# EAGLE design 9volt_rail (EAGLE 7.1.0)
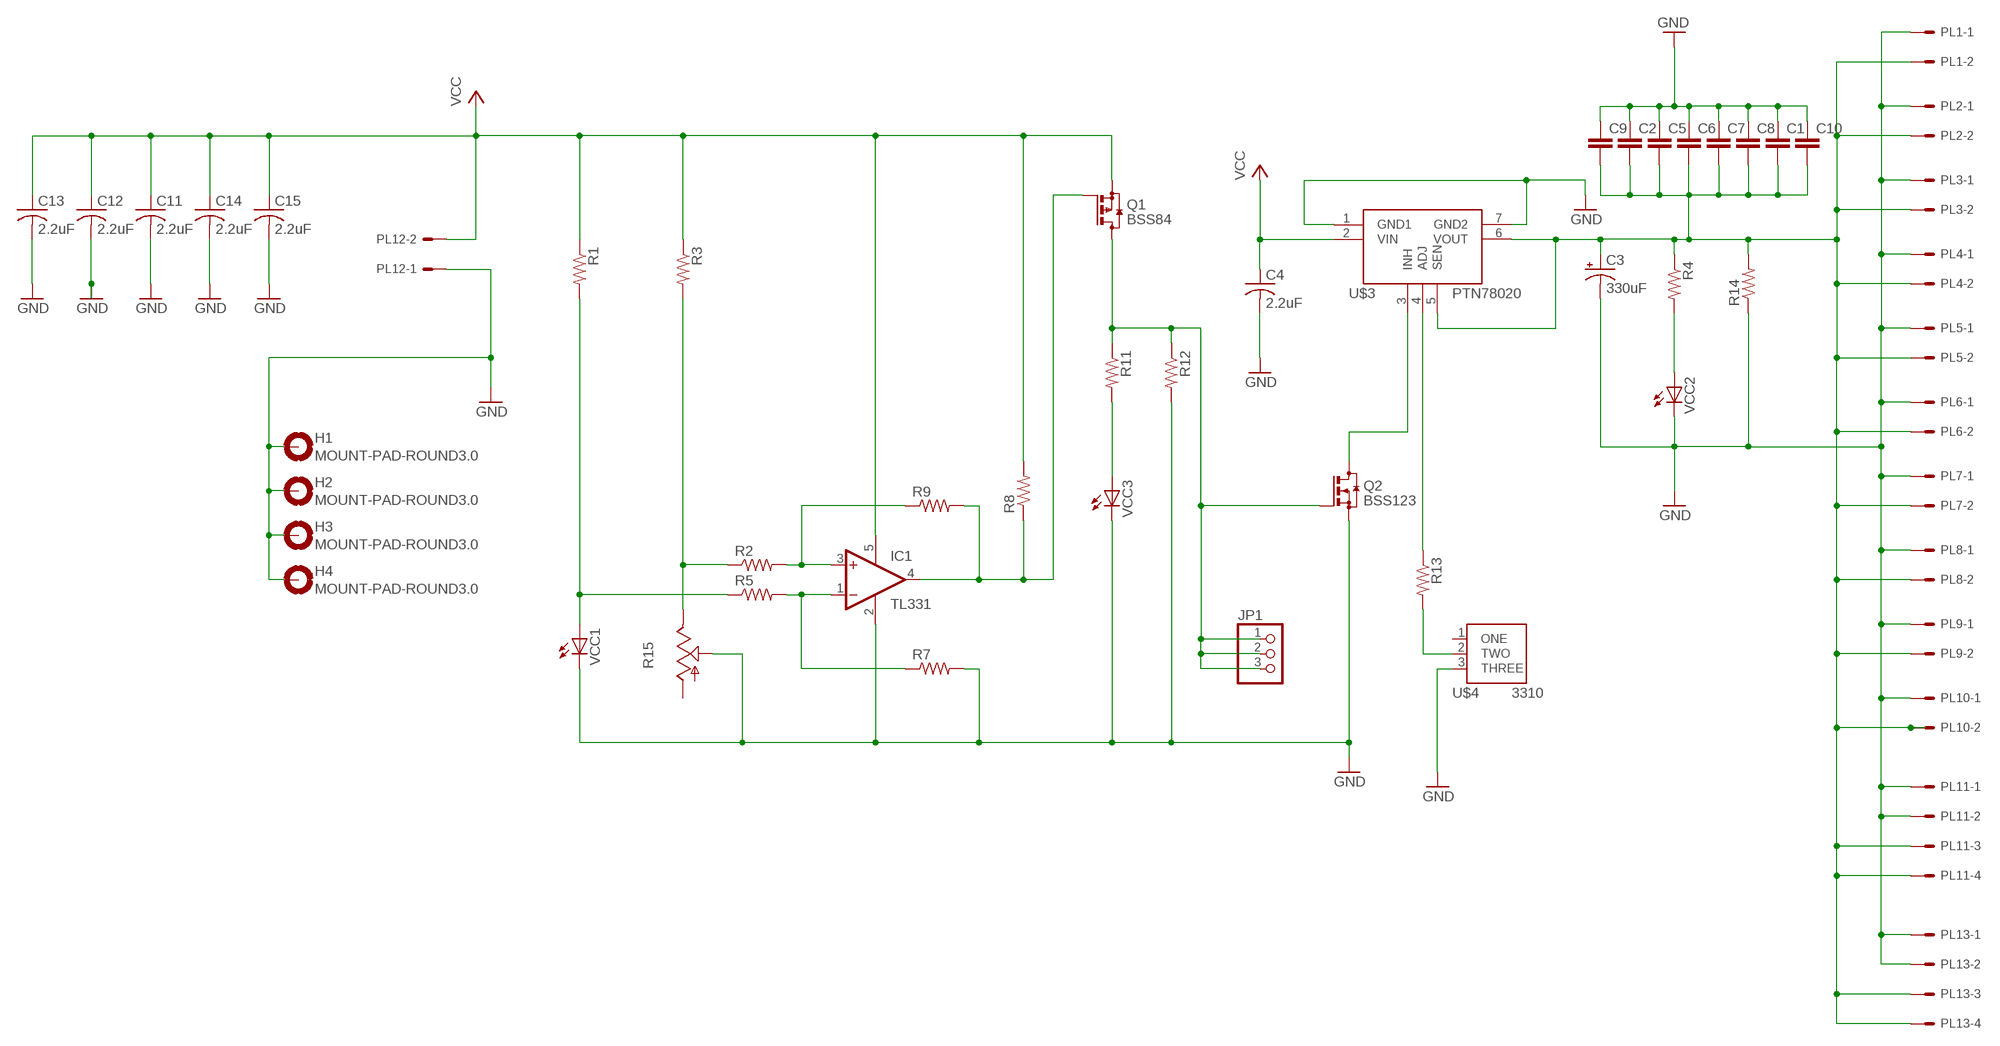
[diagram p0: schematic, sheet 1]

## Parts
C1  C-EUC0805  [C0805]
C2  C-EUC0805  [C0805]
C3  330uF  CPOL-USE5-10.5  [E5-10,5]
C4  2.2uF  C-USC0805  [C0805]
C5  C-EUC0805  [C0805]
C6  C-EUC0805  [C0805]
C7  C-EUC0805  [C0805]
C8  C-EUC0805  [C0805]
C9  C-EUC0805  [C0805]
C10  C-EUC0805  [C0805]
C11  2.2uF  C-USC0805  [C0805]
C12  2.2uF  C-USC0805  [C0805]
C13  2.2uF  C-USC0805  [C0805]
C14  2.2uF  C-USC0805  [C0805]
C15  2.2uF  C-USC0805  [C0805]
H1  MOUNT-PAD-ROUND3.0  [3,0-PAD]
H2  MOUNT-PAD-ROUND3.0  [3,0-PAD]
H3  MOUNT-PAD-ROUND3.0  [3,0-PAD]
H4  MOUNT-PAD-ROUND3.0  [3,0-PAD]
IC1  TL331  [DBV-R-PDSO-G5]
JP1  PINHD-1X3  [1X03]
PL1  555X-2H  [5569-2]
PL2  555X-2H  [5569-2]
PL3  555X-2H  [5569-2]
PL4  555X-2H  [5569-2]
PL5  555X-2H  [5569-2]
PL6  555X-2H  [5569-2]
PL7  555X-2H  [5569-2]
PL8  555X-2H  [5569-2]
PL9  555X-2H  [5569-2]
PL10  555X-2H  [5569-2]
PL11  555X-4H  [5569-4]
PL12  555X-2H  [5569-2]
PL13  555X-4H  [5569-4]
Q1  BSS84  [SOT23]
Q2  BSS123  [SOT23]
R1  R-US_M0805  [M0805]
R2  R-US_M0805  [M0805]
R3  R-US_M0805  [M0805]
R4  R-US_M0805  [M0805]
R5  R-US_M0805  [M0805]
R7  R-US_M0805  [M0805]
R8  R-US_M0805  [M0805]
R9  R-US_M0805  [M0805]
R11  R-US_M0805  [M0805]
R12  R-US_M0805  [M0805]
R13  R-US_M0805  [M0805]
R14  R-US_0617/17  [0617/17]
R15  TRIM_US-S63P  [S63P]
U$3  PTH78020-SMD  [PTN78020-SND]
U$4  3310-001  [3310-001-TH]
VCC1  LED5MM  [LED5MM]
VCC2  LED5MM  [LED5MM]
VCC3  LED5MM  [LED5MM]

## Nets
GND: C1.1 C2.1 C3.- C4.2 C5.1 C6.1 C7.1 C8.1 C9.1 C10.1 C11.2 C12.2 C13.2 C14.2 C15.2 H1.B3,0(MOUNT) H2.B3,0(MOUNT) H3.B3,0(MOUNT) H4.B3,0(MOUNT) IC1.2(GND) PL1.1 PL2.1 PL3.1 PL4.1 PL5.1 PL6.1 PL7.1 PL8.1 PL9.1 PL10.1 PL11.1 PL11.2 PL12.1 PL13.1 PL13.2 Q2.2(S) R7.2 R12.2 R14.1 R15.S U$3.1(GND1) U$3.7(GND2) U$4.3(THREE) VCC1.K(C) VCC2.K(C) VCC3.K(C)
N$1: R13.2 U$4.2(TWO)
N$2: IC1.4(OUT) Q1.1(G) R8.1 R9.2
N$3: R1.2 R5.1 VCC1.A
N$4: IC1.3(+IN) R2.2 R9.1
N$5: JP1.1 JP1.2 JP1.3 Q1.3(D) Q2.1(G) R11.1 R12.1
N$6: R2.1 R3.2 R15.E
N$7: IC1.1(-IN) R5.2 R7.1
N$8: R11.2 VCC3.A
N$9: R4.2 VCC2.A
N$10: Q2.3(D) U$3.3(INH)
N$11: C1.2 C2.2 C3.+ C5.2 C6.2 C7.2 C8.2 C9.2 C10.2 PL1.2 PL2.2 PL3.2 PL4.2 PL5.2 PL6.2 PL7.2 PL8.2 PL9.2 PL10.2 PL11.3 PL11.4 PL13.3 PL13.4 R4.1 R14.2 U$3.5(SEN) U$3.6(VOUT)
N$13: R13.1 U$3.4(ADJ)
VCC: C4.1 C11.1 C12.1 C13.1 C14.1 C15.1 IC1.5(V+) PL12.2 Q1.2(S) R1.1 R3.1 R8.2 U$3.2(VIN)
Unconnected: R15.A U$4.1(ONE)

## Library data of the parts
C1 C2 C5-C10 = rcl:C-EU: CAPACITOR, European symbol
C3 = rcl:CPOL-US: POLARIZED CAPACITOR, American symbol
C4 C11-C15 = adafruit:C-US: CAPACITOR, American symbol
H1-H4 = holes:MOUNT-PAD-ROUND: MOUNTING PAD, round
IC1 = linear:TL331: SINGLE DIFFERENTIAL COMPARATOR Source: Data sheet <http://www.ti.com/lit/ds/symlink/tl331-q1.pdf>
JP1 = adafruit:PINHD-1X3: PIN HEADER
PL1-PL10 PL12 = con-molex-2:555X-2: Mini FIT connector 2 way
PL11 PL13 = con-molex-2:555X-4: Mini FIT connector 4 way
Q1 = transistor-small-signal:BSS84: P-CHANNEL MOS FET
Q2 = transistor-small-signal:BSS123: N-CHANNEL MOS FET
R1-R5 R7-R9 R11-R13 = adafruit:R-US_: RESISTOR, American symbol
R14 = resistor:R-US_: RESISTOR, American symbol
R15 = pot:TRIM_US-: POTENTIOMETER
U$3 = PTN78020:PTH78020-SMD
U$4 = 3310-001:3310-001
VCC1-VCC3 = adafruit:LED: LED OSRAM: - CHIPLED LG R971, LG N971, LY N971, LG Q971, LY Q971, LO R971, LY R971 LH N974, LH R974 LS Q976, LO Q976, LY Q976 LO Q996 - Hyper CHIPLED LW Q18S LB Q993, LB Q99A, LB R99A - SideLED LS A670, LO A670, LY A670, LG A670, LP A670 LB A673, LV A673, LT A673, LW A673 LH A674 LY A675 LS A676, LA A676, LO A676, LY A676, LW A676 LS A679, LY A679, LG A679 - Hyper Micro SIDELED® LS Y876, LA Y876, LO Y876, LY Y876 LT Y87S - SmartLED LW L88C, LW L88S LB L89C, LB L89S, LG L890 LS L89K, LO L89K, LY L89K LS L896, LA L896, LO L896, LY L896 - TOPLED LS T670, LO T670, LY T670, LG T670, LP T670 LSG T670, LSP T670, LSY T670, LOP T670, LYG T670 LG T671, LOG T671, LSG T671 LB T673, LV T673, LT T673, LW T673 LH T674 LS T676, LA T676, LO T676, LY T676, LB T676, LH T676, LSB T676, LW T676 LB T67C, LV T67C, LT T67C, LS T67K, LO T67K, LY T67K, LW E67C LS E67B, LA E67B, LO E67B, LY E67B, LB E67C, LV E67C, LT E67C LW T67C LS T679, LY T679, LG T679 LS T770, LO T770, LY T770, LG T770, LP T770 LB T773, LV T773, LT T773, LW T773 LH T774 LS E675, LA E675, LY E675, LS T675 LS T776, LA T776, LO T776, LY T776, LB T776 LHGB T686 LT T68C, LB T68C - Hyper Mini TOPLED® LB M676 - Mini TOPLED Santana® LG M470 LS M47K, LO M47K, LY M47K Source: http://www.osram.convergy.de/

## Net classes
0 default: width 0.203 mm, drill 0.508 mm, clearance 0.254 mm

## Board
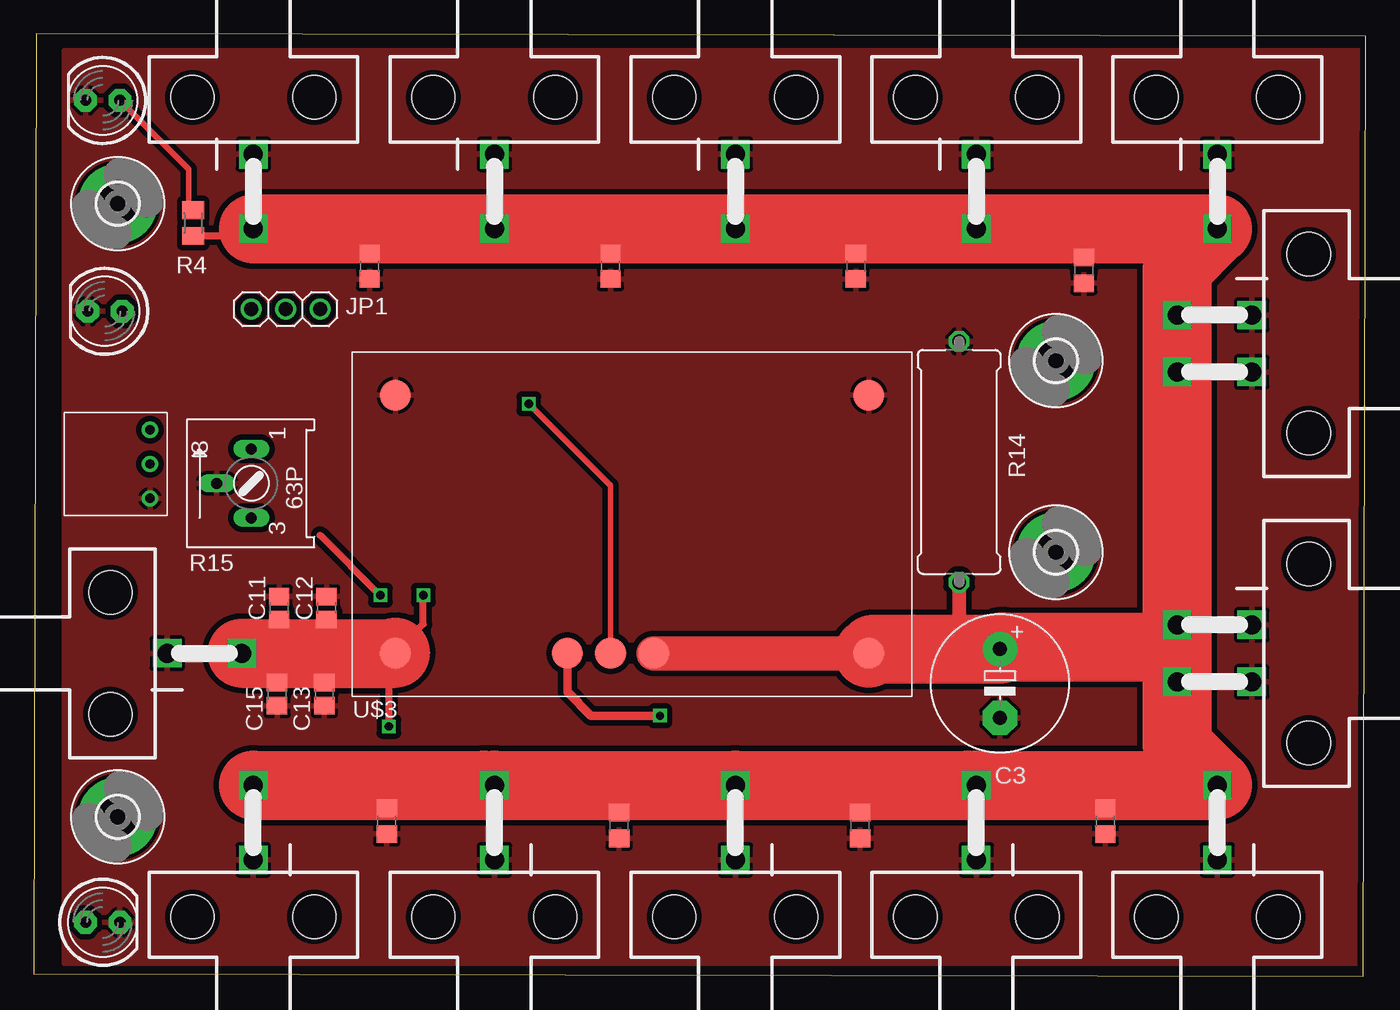
[diagram p1: board, top side]
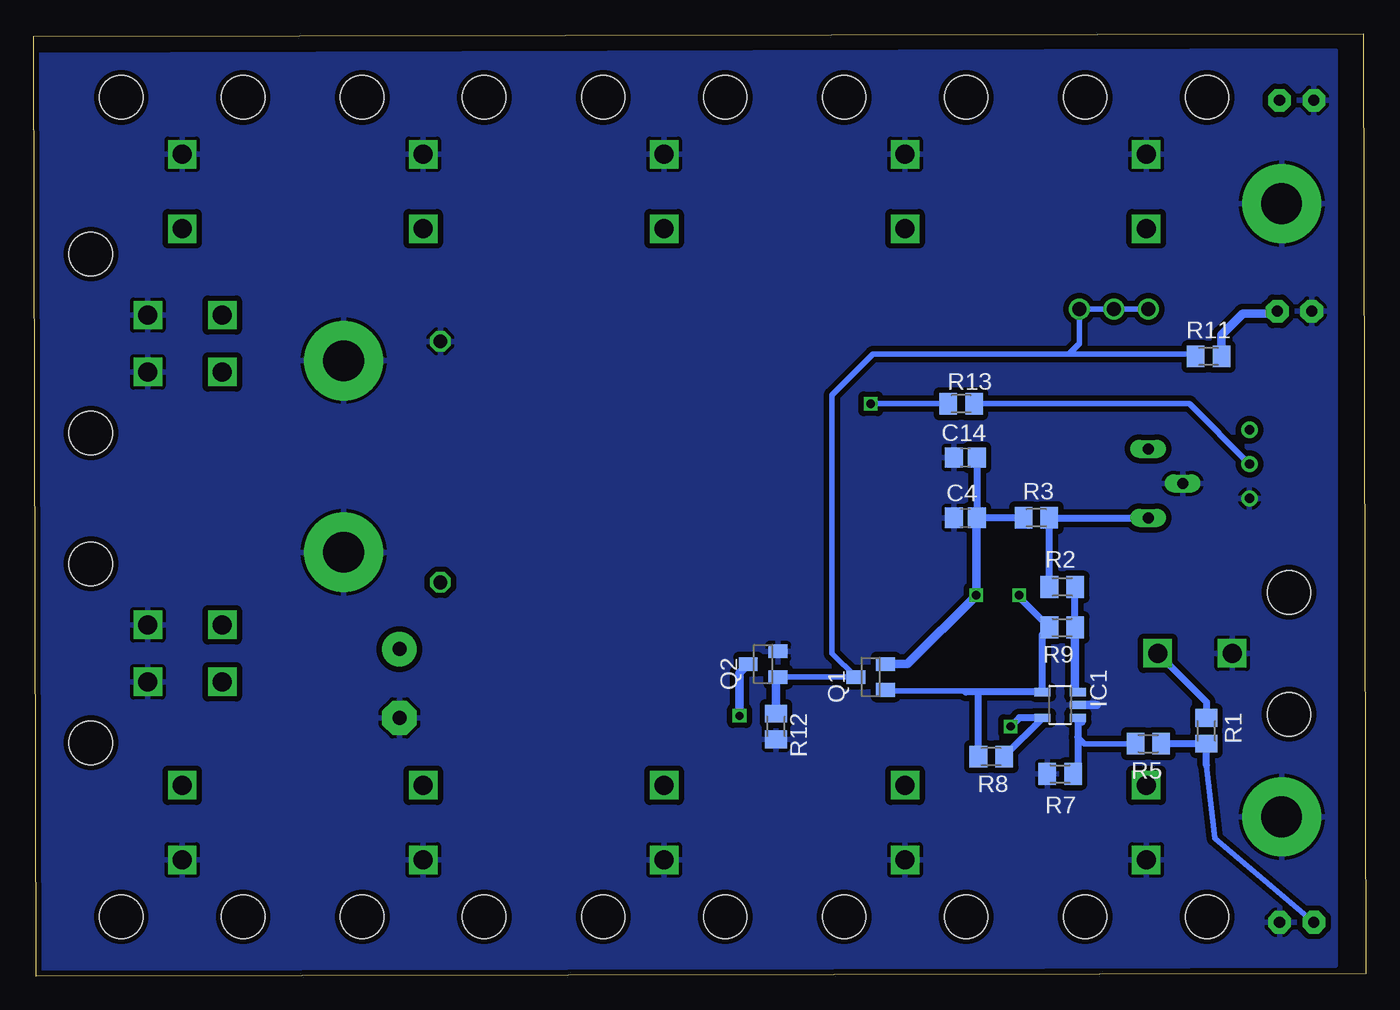
[diagram p2: board, bottom side, seen from below]

Size 98.25 x 69.52 mm. Coordinates in mm from the lower left corner, seen from the top.
Outline: 0,0.16 98.1,0 98.25,69.36 0.16,69.52 0,0.16
Copper layers (1*16): Top 0.035mm / dielectric 1.5mm / Bottom 0.035mm
Design rules "default *": minimum track width 8mil, minimum drill 15mil, track to track 8mil, track to pad 8mil, pad to pad 8mil, via to via 8mil, smd to smd 8mil, copper to edge 8mil, drill to drill 8mil, minimum pad ring 10mil, minimum via ring 8mil, stop-mask expansion 4mil, vias tented up to drill 0mil, thermal gap 10mil

### Footprints (pad centres in the part's own frame; a part is rotated, then mirrored left to right if it is on the bottom)
C0805 = smd 1.3 x 1.5: 1 -0.95,0; 2 0.95,0
E5-10,5 = drill 1.016 pad 2.54: + -2.54,0 | drill 1.016 pad 2.54 octagon: - 2.54,0
C0805' = smd 1.3 x 1.5: 1 -0.85,0; 2 0.85,0
3,0-PAD = drill 3 pad 5.842: B3,0 0,0
DBV-R-PDSO-G5 = smd 0.6 x 1.2: 1 -0.95,-1.306; 2 0,-1.306; 3 0.95,-1.306; 4 0.95,1.306; 5 -0.95,1.306
1X03 = drill 1.016: 1 -2.54,0; 2 0,0; 3 2.54,0
5569-2 = drill 1.4 square: 1 0,0; 2 0,5.5 | hole 3.2: 4.5,-4.2; -4.5,-4.2
5569-4 = drill 1.4 square: 1 2.1,0; 2 -2.1,0; 3 2.1,5.5; 4 -2.1,5.5 | hole 3.2: 6.6,-4.2; -6.6,-4.2
SOT23 = smd 1 x 1.4: 1 -0.95,-1.1; 2 0.95,-1.1; 3 0,1.1
M0805 = smd 1.3 x 1.6: 1 -0.95,0; 2 0.95,0
0617/17 = drill 1.016 octagon: 1 -8.89,0; 2 8.89,0
S63P = drill 0.813 long: A 2.54,0; E -2.54,0; S 0,2.54
PTN78020-SND = smd 2.286 x 2.286: 1 -17.462,9.525; 2 -17.462,-9.525; 3 -4.763,-9.525; 4 -1.587,-9.525; 5 1.587,-9.525; 6 17.462,-9.525; 7 17.462,9.525
3310-001-TH = drill 0.7: 1 2.54,0; 2 0,0; 3 -2.54,0
LED5MM = drill 0.813 pad 1.676 octagon: A -1.27,0; K 1.27,0

### Placement (x,y rotation side)
C1  42.55,52.39 90 top
C2  60.64,52.39 90 top
C3  71.28,21.59 270 top
C4  2.2uF  [C0805']  29.53,33.81 180 bottom
C5  77.47,52.07 90 top
C6  79.06,11.43 90 top
C7  26.04,11.43 90 top
C8  43.18,11.11 90 top
C9  60.96,11.11 90 top
C10  24.77,52.39 90 top
C11  2.2uF  [C0805']  18.1,27.15 90 top
C12  2.2uF  [C0805']  21.59,27.15 90 top
C13  2.2uF  [C0805']  21.43,20.8 270 top
C14  2.2uF  [C0805']  29.53,38.26 180 bottom
C15  2.2uF  [C0805']  17.94,20.8 270 top
H1  75.41,31.27 0 top
H2  6.19,56.99 0 top
H3  6.19,11.75 0 top
H4  75.41,45.4 0 top
IC1  22.54,20 90 bottom
JP1  18.57,49.21 180 top
PL1  16.19,8.57 0 top
PL2  33.97,8.57 0 top
PL3  51.75,8.57 0 top
PL4  69.53,8.57 0 top
PL5  51.75,60.64 180 top
PL6  87.31,8.57 0 top
PL7  87.31,60.64 180 top
PL8  69.53,60.64 180 top
PL9  33.97,60.64 180 top
PL10  16.19,60.64 180 top
PL11  89.85,23.81 90 top
PL12  9.84,23.81 270 top
PL13  89.85,46.67 90 top
Q1  36.51,22.07 90 bottom
Q2  44.45,23.02 90 bottom
R1  11.75,18.1 270 bottom
R2  22.38,28.71 0 bottom
R3  24.29,33.81 0 bottom
R4  11.75,55.56 90 top
R5  16.03,17.14 180 bottom
R7  22.54,14.92 180 bottom
R8  27.62,16.19 0 bottom
R9  22.38,25.72 180 bottom
R11  11.59,45.72 0 bottom
R12  43.5,18.41 270 bottom
R13  29.84,42.23 0 bottom
R14  68.26,37.94 270 top
R15  16.03,36.35 90 top
U$3  44.13,33.34 0 top
U$4  8.57,37.78 90 top
VCC1  5.08,3.97 0 top
VCC2  5.08,64.61 180 top
VCC3  5.24,49.05 180 top

### Tracks (layer width: path | path; a pad name or v marks a point on that pad's centre or on a via)
GND
  Bottom 0.61: IC1.2 19.84,20
  pour Top (isolate 0.406): 2.22,68.26 99.22,68.26 99.22,0.95 2.22,0.95
  pour Bottom (isolate 0.406): 2.22,68.26 2.22,0.79 98.9,0.48 98.9,67.95
N$1
  Bottom 0.406: R13.2 13.02,42.23 U$4.2 8.73,37.62
N$2  (via drill 0.6)
  Top 0.508: 21.11,32.54 v25.56,28.1
  Bottom 0.406: 29.52,20.95 29.52,21.02 35.41,21.02 Q1.1
  Bottom 0.508: 28.57,20.95 IC1.4 23.85,25.2 R9.2 | 28.57,20.95 29.52,20.95 | R9.2 23.33,26.03 | v25.56,28.1 25.56,27.94 R9.2 | R8.1 28.57,20.95
N$3
  Bottom 0.406: 11.75,15.56 11.11,10.16 VCC1.A
  Bottom 0.508: 11.75,15.56 R1.2 13.66,17.15 R5.1
N$4
  Bottom 0.508: R9.1 R2.2
  Bottom 0.61: IC1.3 21.43,21.15 R9.1
N$5
  Bottom 0.406: 43.5,21.92 Q2.1 Q1.3 39.37,23.82 39.37,42.86 36.35,45.88 21.91,45.88 | 21.91,45.88 12.7,45.88 R11.1 | 21.91,45.88 21.11,46.67 JP1.1 JP1.2 JP1.3
  Bottom 0.61: 43.5,21.92 R12.1
N$6
  Bottom 0.508: R2.1 23.33,33.81 | 23.33,33.81 R3.2 | 23.33,33.81 R15.E
N$7
  Bottom 0.406: R5.2 20.76,17.14 21.24,17.62
  Bottom 0.508: 20.92,18.73 IC1.1 21.24,17.62 21.24,15.28 R7.1
N$8
  Bottom 0.61: R11.2 10.64,47.3 9.05,48.9 6.67,48.9 VCC3.A
N$9
  Top 0.406: 11.43,56.83 11.43,59.53 VCC2.A
  Top 0.508: R4.2 11.43,56.83
N$10  (via drill 0.6)
  Top 0.61: U$3.3 39.37,20.96 41.12,19.21 v46.2,19.21
  Bottom 0.61: v46.2,19.21 46.2,22.37 Q2.3
N$11
  Top 0.508: C10.2 18,53.34 PL10.2 15.66,54.61 R4.1 | C1.2 35.78,53.34 PL9.2 | C2.2 53.56,53.34 PL5.2 | C5.2 77.95,53.5 77.95,55.14 | C6.2 80.75,14.07 PL6.2 | C9.2 62.97,14.07 68.9,14.07 | C8.2 45.19,14.07 PL3.2 | C7.2 27.73,14.07 33.18,14.07 | 82.91,25.91 PL11.3
  Top 1.016: R14.2 68.26,24.92 | 68.26,24.92 68.1,24.76 | 68.26,24.92 70.49,24.92 C3.+
  Top 2.54: U$3.5 U$3.6
  Top 5.08: PL1.2 33.18,14.07 PL2.2 PL3.2 68.9,14.07 PL4.2 PL6.2 84.35,17.03 PL11.4 84.35,24.29 | 84.35,24.29 PL11.3 PL13.4 PL13.3 84.35,52.18 PL7.2 77.95,55.14 PL8.2 PL5.2 PL9.2 PL10.2 | U$3.6 61.91,24.13 C3.+ 71.44,24.29 84.35,24.29
N$13  (via drill 0.6)
  Top 0.406: U$3.4 42.55,36.19 v36.51,42.23
  Bottom 0.406: v36.51,42.23 R13.1
VCC  (via drill 0.6)
  Top 0.508: C11.1 17.83,26.3 PL12.2 | C15.1 17.94,21.75 15.88,23.81 | C13.1 17.51,21.65 PL12.2 | v26.19,18.41 26.19,23.34 U$3.2 | 26.67,23.91 28.73,25.98 v28.73,28.1 | C12.1 19.11,23.81 PL12.2
  Top 5.08: 26.67,23.91 U$3.2 15.88,23.81 PL12.2
  Bottom 0.508: PL12.2 11.75,20.22 R1.1 | R8.2 23.85,19.02 IC1.5 25.56,19.05 v26.19,18.41 | C14.1 C4.1 | R3.1 C4.1 | C4.1 28.73,33.76
  Bottom 0.61: Q1.2 33.82,23.02 v28.73,28.1 28.73,33.76